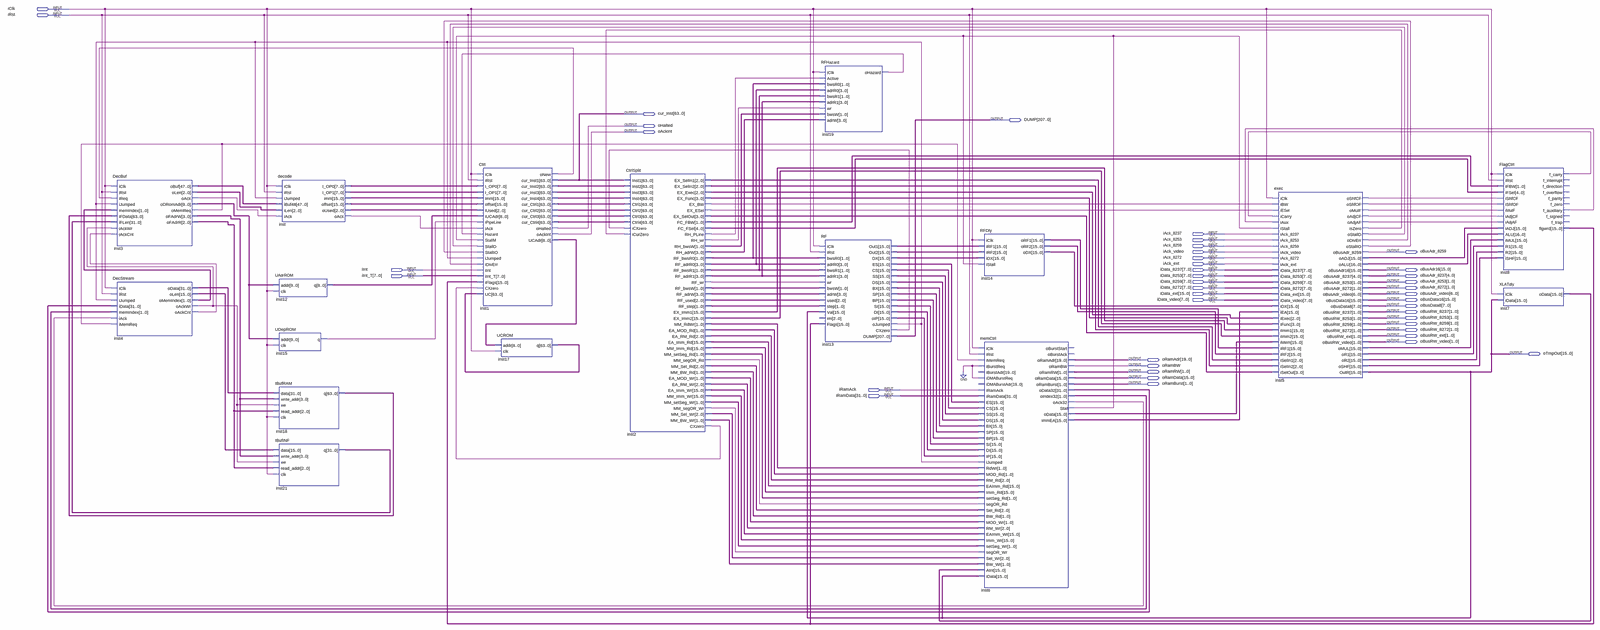
[diagram p0: schematic sheet, whole]
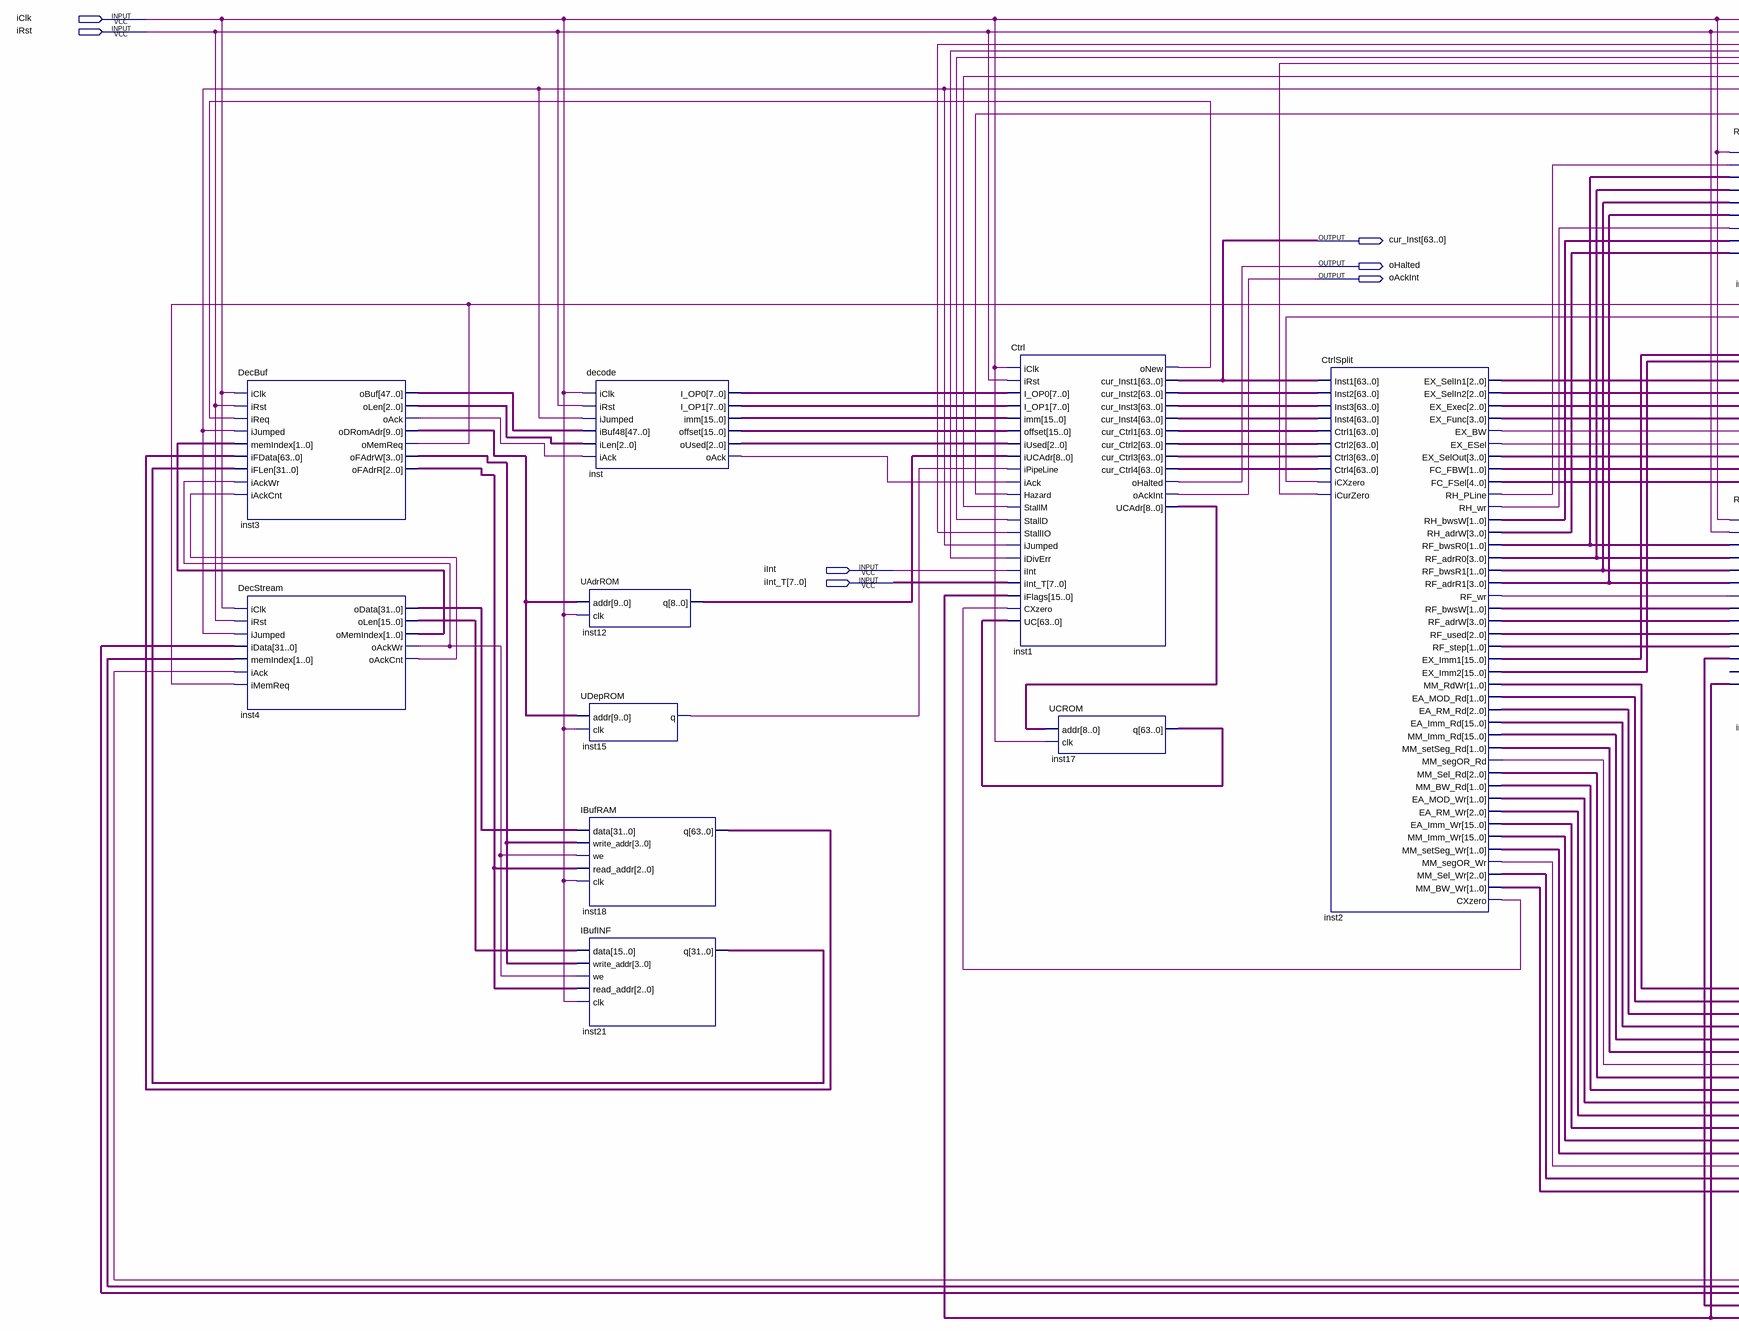
[diagram p1: schematic sheet, left part]
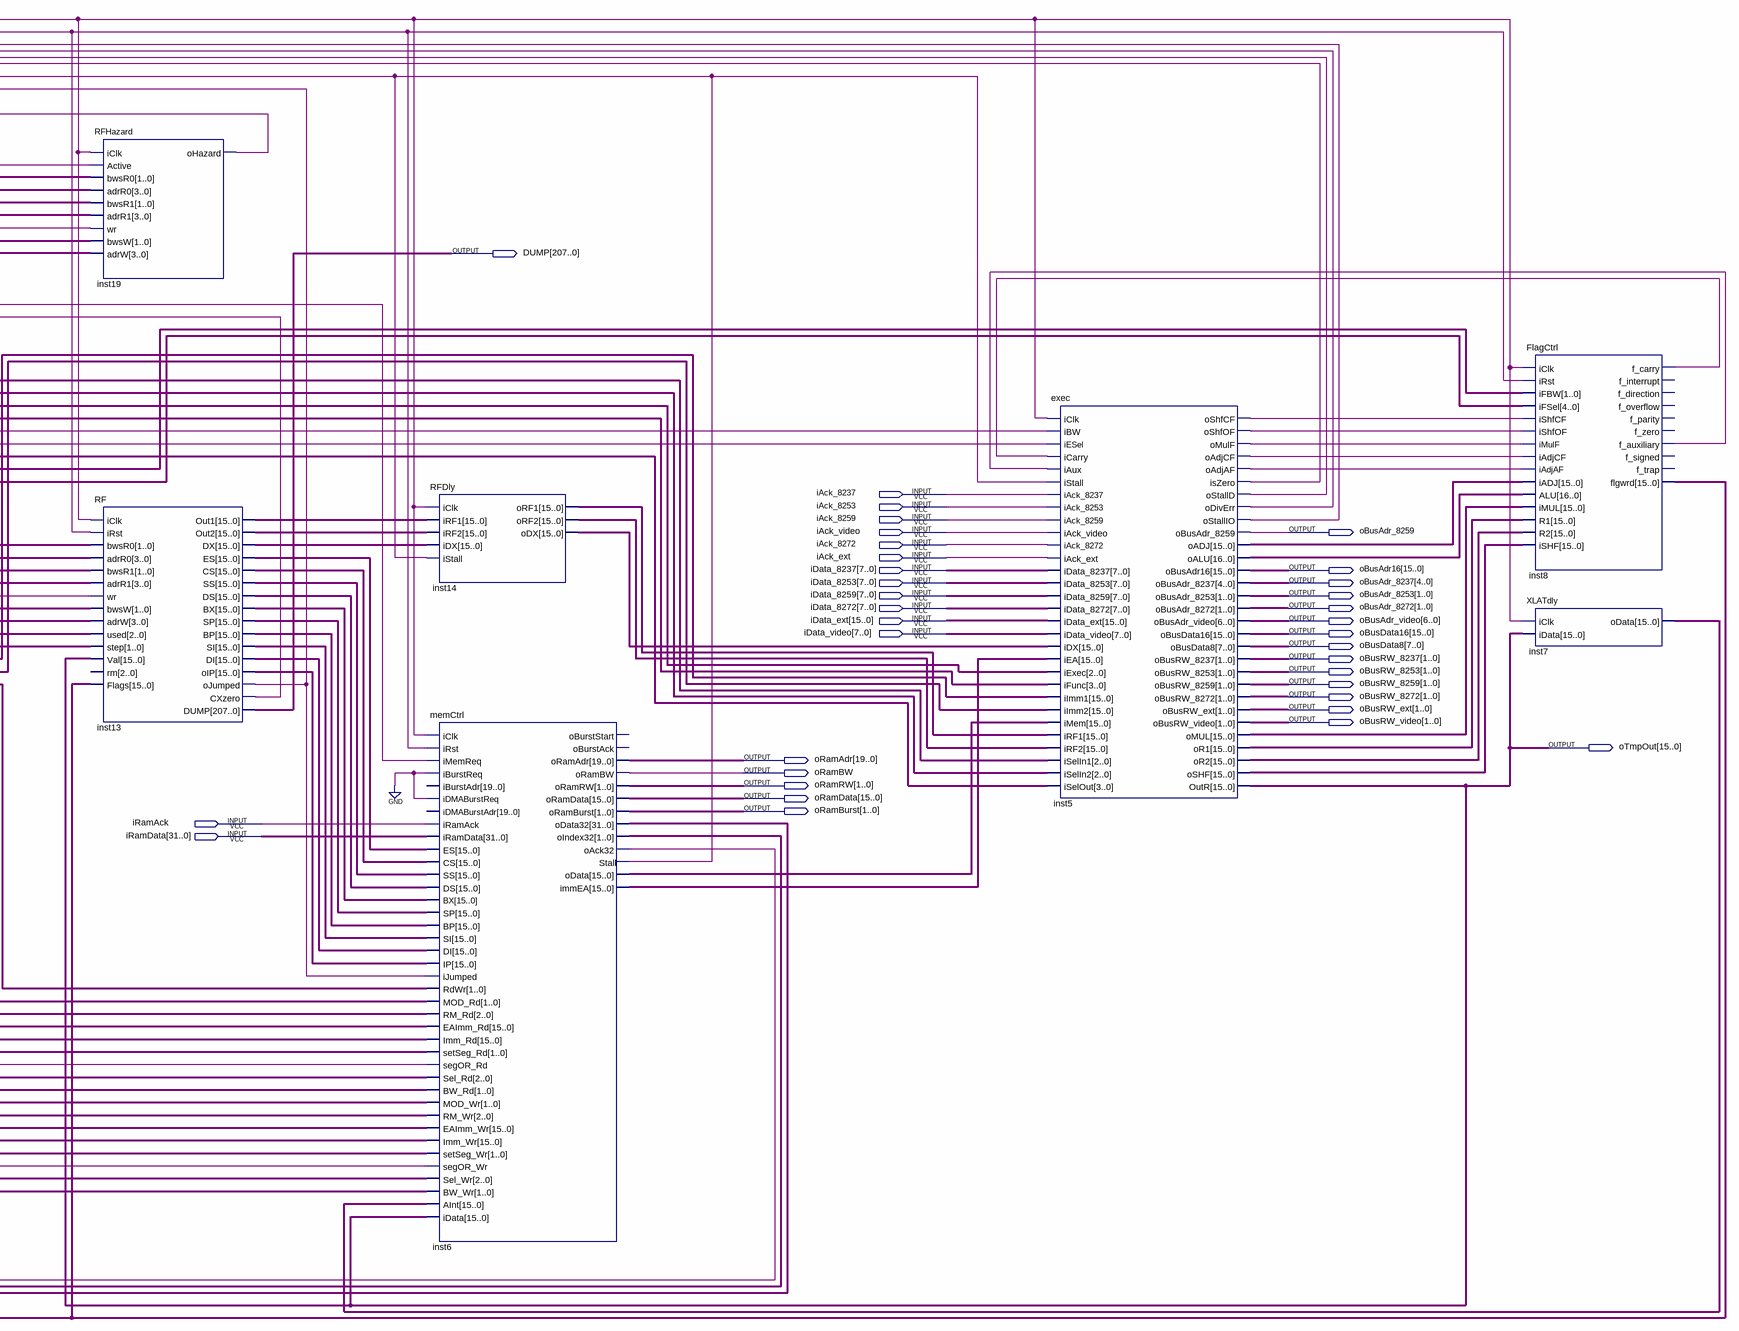
[diagram p2: schematic sheet, right part]
// Quartus schematic cpu_top.bdf as structural Verilog: 17 symbols, 42 pins
module cpu_top (
  input  iClk,
  input  iRst,
  input  iAck_8237,
  input  iAck_8253,
  input  iAck_8259,
  input  iAck_video,
  input  iAck_8272,
  input  iAck_ext,
  input  iInt,
  input  [7:0] iData_8237,
  input  [7:0] iInt_T,
  input  [7:0] iData_8253,
  input  [7:0] iData_8259,
  input  [7:0] iData_8272,
  input  [15:0] iData_ext,
  input  [7:0] iData_video,
  input  iRamAck,
  input  [31:0] iRamData,
  output [63:0] cur_Inst,
  output [207:0] DUMP,
  output oHalted,
  output oAckInt,
  output oBusAdr_8259,
  output [15:0] oBusAdr16,
  output [4:0] oBusAdr_8237,
  output [1:0] oBusAdr_8253,
  output [1:0] oBusAdr_8272,
  output [6:0] oBusAdr_video,
  output [15:0] oBusData16,
  output [7:0] oBusData8,
  output [1:0] oBusRW_8237,
  output [1:0] oBusRW_8253,
  output [1:0] oBusRW_8259,
  output [1:0] oBusRW_8272,
  output [1:0] oBusRW_ext,
  output [1:0] oBusRW_video,
  output [15:0] oTmpOut,
  output [19:0] oRamAdr,
  output oRamBW,
  output [1:0] oRamRW,
  output [15:0] oRamData,
  output [1:0] oRamBurst
);

  wire inst1_onew, inst2_cxzero, inst2_ex_bw, inst2_ex_esel, inst2_mm_segor_rd, inst2_mm_segor_wr,
       inst2_rf_wr, inst2_rh_pline, inst2_rh_wr, inst3_oack, inst3_omemreq, inst4_oackcnt, inst4_oackwr,
       inst5_iszero, inst5_oadjaf, inst5_oadjcf, inst5_odiverr, inst5_omulf, inst5_oshfcf, inst5_oshfof,
       inst5_ostalld, inst5_ostallio, inst6_oack32, inst6_stall, inst8_f_auxiliary, inst8_f_carry,
       inst13_cxzero, inst13_ojumped, inst15_q, inst19_ohazard, inst_oack;
  wire [1:0] inst2_ea_mod_rd, inst2_ea_mod_wr, inst2_fc_fbw, inst2_mm_bw_rd, inst2_mm_bw_wr, inst2_mm_rdwr,
       inst2_mm_setseg_rd, inst2_mm_setseg_wr, inst2_rf_bwsr0, inst2_rf_bwsr1, inst2_rf_bwsw, inst2_rf_step,
       inst2_rh_bwsw, inst4_omemindex, inst6_oindex32;
  wire [2:0] inst2_ea_rm_rd, inst2_ea_rm_wr, inst2_ex_exec, inst2_ex_selin1, inst2_ex_selin2,
       inst2_mm_sel_rd, inst2_mm_sel_wr, inst2_rf_used, inst3_ofadrr, inst3_olen, inst_oused;
  wire [3:0] inst2_ex_func, inst2_ex_selout, inst2_rf_adrr0, inst2_rf_adrr1, inst2_rf_adrw, inst2_rh_adrw,
       inst3_ofadrw;
  wire [4:0] inst2_fc_fsel;
  wire [7:0] inst_i_op0, inst_i_op1;
  wire [8:0] inst1_ucadr, inst12_q;
  wire [9:0] inst3_odromadr;
  wire [15:0] inst2_ea_imm_rd, inst2_ea_imm_wr, inst2_ex_imm1, inst2_ex_imm2, inst2_mm_imm_rd,
       inst2_mm_imm_wr, inst4_olen, inst5_oadj, inst5_omul, inst5_or1, inst5_or2, inst5_oshf, inst6_immea,
       inst6_odata, inst7_odata, inst8_flgwrd, inst13_bp, inst13_bx, inst13_cs, inst13_di, inst13_ds,
       inst13_dx, inst13_es, inst13_oip, inst13_out1, inst13_out2, inst13_si, inst13_sp, inst13_ss,
       inst14_odx, inst14_orf1, inst14_orf2, inst_imm, inst_offset;
  wire [16:0] inst5_oalu;
  wire [31:0] inst4_odata, inst6_odata32, inst21_q;
  wire [47:0] inst3_obuf;
  wire [63:0] inst1_cur_ctrl1, inst1_cur_ctrl2, inst1_cur_ctrl3, inst1_cur_ctrl4, inst1_cur_inst2,
       inst1_cur_inst3, inst1_cur_inst4, inst17_q, inst18_q;

  DecBuf inst3 (
    .iClk(iClk), .iRst(iRst), .iReq(inst1_onew), .iJumped(inst13_ojumped), .memIndex(inst4_omemindex),
    .iFData(inst18_q), .iFLen(inst21_q), .iAckWr(inst4_oackwr), .iAckCnt(inst4_oackcnt), .oBuf(inst3_obuf),
    .oLen(inst3_olen), .oAck(inst3_oack), .oDRomAdr(inst3_odromadr), .oMemReq(inst3_omemreq),
    .oFAdrW(inst3_ofadrw), .oFAdrR(inst3_ofadrr));
  DecStream inst4 (
    .iClk(iClk), .iRst(iRst), .iJumped(inst13_ojumped), .iData(inst6_odata32), .memIndex(inst6_oindex32),
    .iAck(inst6_oack32), .iMemReq(inst3_omemreq), .oData(inst4_odata), .oLen(inst4_olen),
    .oMemIndex(inst4_omemindex), .oAckWr(inst4_oackwr), .oAckCnt(inst4_oackcnt));
  UAdrROM inst12 (.addr(inst3_odromadr), .clk(iClk), .q(inst12_q));
  UDepROM inst15 (.addr(inst3_odromadr), .clk(iClk), .q(inst15_q));
  IBufRAM inst18 (
    .data(inst4_odata), .write_addr(inst3_ofadrw), .we(inst4_oackwr), .read_addr(inst3_ofadrr), .clk(iClk),
    .q(inst18_q));
  IBufINF inst21 (
    .data(inst4_olen), .write_addr(inst3_ofadrw), .we(inst4_oackwr), .read_addr(inst3_ofadrr), .clk(iClk),
    .q(inst21_q));
  decode inst (
    .iClk(iClk), .iRst(iRst), .iJumped(inst13_ojumped), .iBuf48(inst3_obuf), .iLen(inst3_olen),
    .iAck(inst3_oack), .I_OP0(inst_i_op0), .I_OP1(inst_i_op1), .imm(inst_imm), .offset(inst_offset),
    .oUsed(inst_oused), .oAck(inst_oack));
  Ctrl inst1 (
    .iClk(iClk), .iRst(iRst), .I_OP0(inst_i_op0), .I_OP1(inst_i_op1), .imm(inst_imm), .offset(inst_offset),
    .iUsed(inst_oused), .iUCAdr(inst12_q), .iPipeLine(inst15_q), .iAck(inst_oack), .Hazard(inst19_ohazard),
    .StallM(inst6_stall), .StallD(inst5_ostalld), .StallIO(inst5_ostallio), .iJumped(inst13_ojumped),
    .iDivErr(inst5_odiverr), .iInt(iInt), .iInt_T(iInt_T), .iFlags(inst8_flgwrd), .CXzero(inst2_cxzero),
    .UC(inst17_q), .oNew(inst1_onew), .cur_Inst1(cur_Inst), .cur_Inst2(inst1_cur_inst2),
    .cur_Inst3(inst1_cur_inst3), .cur_Inst4(inst1_cur_inst4), .cur_Ctrl1(inst1_cur_ctrl1),
    .cur_Ctrl2(inst1_cur_ctrl2), .cur_Ctrl3(inst1_cur_ctrl3), .cur_Ctrl4(inst1_cur_ctrl4), .oHalted(oHalted),
    .oAckInt(oAckInt), .UCAdr(inst1_ucadr));
  UCROM inst17 (.addr(inst1_ucadr), .clk(iClk), .q(inst17_q));
  CtrlSplit inst2 (
    .Inst1(cur_Inst), .Inst2(inst1_cur_inst2), .Inst3(inst1_cur_inst3), .Inst4(inst1_cur_inst4),
    .Ctrl1(inst1_cur_ctrl1), .Ctrl2(inst1_cur_ctrl2), .Ctrl3(inst1_cur_ctrl3), .Ctrl4(inst1_cur_ctrl4),
    .iCXzero(inst13_cxzero), .iCurZero(inst5_iszero), .EX_SelIn1(inst2_ex_selin1),
    .EX_SelIn2(inst2_ex_selin2), .EX_Exec(inst2_ex_exec), .EX_Func(inst2_ex_func), .EX_BW(inst2_ex_bw),
    .EX_ESel(inst2_ex_esel), .EX_SelOut(inst2_ex_selout), .FC_FBW(inst2_fc_fbw), .FC_FSel(inst2_fc_fsel),
    .RH_PLine(inst2_rh_pline), .RH_wr(inst2_rh_wr), .RH_bwsW(inst2_rh_bwsw), .RH_adrW(inst2_rh_adrw),
    .RF_bwsR0(inst2_rf_bwsr0), .RF_adrR0(inst2_rf_adrr0), .RF_bwsR1(inst2_rf_bwsr1),
    .RF_adrR1(inst2_rf_adrr1), .RF_wr(inst2_rf_wr), .RF_bwsW(inst2_rf_bwsw), .RF_adrW(inst2_rf_adrw),
    .RF_used(inst2_rf_used), .RF_step(inst2_rf_step), .EX_Imm1(inst2_ex_imm1), .EX_Imm2(inst2_ex_imm2),
    .MM_RdWr(inst2_mm_rdwr), .EA_MOD_Rd(inst2_ea_mod_rd), .EA_RM_Rd(inst2_ea_rm_rd),
    .EA_Imm_Rd(inst2_ea_imm_rd), .MM_Imm_Rd(inst2_mm_imm_rd), .MM_setSeg_Rd(inst2_mm_setseg_rd),
    .MM_segOR_Rd(inst2_mm_segor_rd), .MM_Sel_Rd(inst2_mm_sel_rd), .MM_BW_Rd(inst2_mm_bw_rd),
    .EA_MOD_Wr(inst2_ea_mod_wr), .EA_RM_Wr(inst2_ea_rm_wr), .EA_Imm_Wr(inst2_ea_imm_wr),
    .MM_Imm_Wr(inst2_mm_imm_wr), .MM_setSeg_Wr(inst2_mm_setseg_wr), .MM_segOR_Wr(inst2_mm_segor_wr),
    .MM_Sel_Wr(inst2_mm_sel_wr), .MM_BW_Wr(inst2_mm_bw_wr), .CXzero(inst2_cxzero));
  RFHazard inst19 (
    .iClk(iClk), .Active(inst2_rh_pline), .bwsR0(inst2_rf_bwsr0), .adrR0(inst2_rf_adrr0),
    .bwsR1(inst2_rf_bwsr1), .adrR1(inst2_rf_adrr1), .wr(inst2_rh_wr), .bwsW(inst2_rh_bwsw),
    .adrW(inst2_rh_adrw), .oHazard(inst19_ohazard));
  RF inst13 (
    .iClk(iClk), .iRst(iRst), .bwsR0(inst2_rf_bwsr0), .adrR0(inst2_rf_adrr0), .bwsR1(inst2_rf_bwsr1),
    .adrR1(inst2_rf_adrr1), .wr(inst2_rf_wr), .bwsW(inst2_rf_bwsw), .adrW(inst2_rf_adrw),
    .used(inst2_rf_used), .step(inst2_rf_step), .Val(oTmpOut), .Flags(inst8_flgwrd), .Out1(inst13_out1),
    .Out2(inst13_out2), .DX(inst13_dx), .ES(inst13_es), .CS(inst13_cs), .SS(inst13_ss), .DS(inst13_ds),
    .BX(inst13_bx), .SP(inst13_sp), .BP(inst13_bp), .SI(inst13_si), .DI(inst13_di), .oIP(inst13_oip),
    .oJumped(inst13_ojumped), .CXzero(inst13_cxzero), .DUMP(DUMP));  // open: rm
  RFDly inst14 (
    .iClk(iClk), .iRF1(inst13_out1), .iRF2(inst13_out2), .iDX(inst13_dx), .iStall(inst6_stall),
    .oRF1(inst14_orf1), .oRF2(inst14_orf2), .oDX(inst14_odx));
  memCtrl inst6 (
    .iClk(iClk), .iRst(iRst), .iMemReq(inst3_omemreq), .iBurstReq(1'b0), .iDMABurstReq(1'b0),
    .iRamAck(iRamAck), .iRamData(iRamData), .ES(inst13_es), .CS(inst13_cs), .SS(inst13_ss), .DS(inst13_ds),
    .BX(inst13_bx), .SP(inst13_sp), .BP(inst13_bp), .SI(inst13_si), .DI(inst13_di), .IP(inst13_oip),
    .iJumped(inst13_ojumped), .RdWr(inst2_mm_rdwr), .MOD_Rd(inst2_ea_mod_rd), .RM_Rd(inst2_ea_rm_rd),
    .EAImm_Rd(inst2_ea_imm_rd), .Imm_Rd(inst2_mm_imm_rd), .setSeg_Rd(inst2_mm_setseg_rd),
    .segOR_Rd(inst2_mm_segor_rd), .Sel_Rd(inst2_mm_sel_rd), .BW_Rd(inst2_mm_bw_rd), .MOD_Wr(inst2_ea_mod_wr),
    .RM_Wr(inst2_ea_rm_wr), .EAImm_Wr(inst2_ea_imm_wr), .Imm_Wr(inst2_mm_imm_wr),
    .setSeg_Wr(inst2_mm_setseg_wr), .segOR_Wr(inst2_mm_segor_wr), .Sel_Wr(inst2_mm_sel_wr),
    .BW_Wr(inst2_mm_bw_wr), .AInt(inst7_odata), .iData(oTmpOut), .oRamAdr(oRamAdr), .oRamBW(oRamBW),
    .oRamRW(oRamRW), .oRamData(oRamData), .oRamBurst(oRamBurst), .oData32(inst6_odata32),
    .oIndex32(inst6_oindex32), .oAck32(inst6_oack32), .Stall(inst6_stall), .oData(inst6_odata),
    .immEA(inst6_immea));  // open: iBurstAdr, iDMABurstAdr, oBurstStart, oBurstAck
  exec inst5 (
    .iClk(iClk), .iBW(inst2_ex_bw), .iESel(inst2_ex_esel), .iCarry(inst8_f_carry), .iAux(inst8_f_auxiliary),
    .iStall(inst6_stall), .iAck_8237(iAck_8237), .iAck_8253(iAck_8253), .iAck_8259(iAck_8259),
    .iAck_video(iAck_video), .iAck_8272(iAck_8272), .iAck_ext(iAck_ext), .iData_8237(iData_8237),
    .iData_8253(iData_8253), .iData_8259(iData_8259), .iData_8272(iData_8272), .iData_ext(iData_ext),
    .iData_video(iData_video), .iDX(inst14_odx), .iEA(inst6_immea), .iExec(inst2_ex_exec),
    .iFunc(inst2_ex_func), .iImm1(inst2_ex_imm1), .iImm2(inst2_ex_imm2), .iMem(inst6_odata),
    .iRF1(inst14_orf1), .iRF2(inst14_orf2), .iSelIn1(inst2_ex_selin1), .iSelIn2(inst2_ex_selin2),
    .iSelOut(inst2_ex_selout), .oShfCF(inst5_oshfcf), .oShfOF(inst5_oshfof), .oMulF(inst5_omulf),
    .oAdjCF(inst5_oadjcf), .oAdjAF(inst5_oadjaf), .isZero(inst5_iszero), .oStallD(inst5_ostalld),
    .oDivErr(inst5_odiverr), .oStallIO(inst5_ostallio), .oBusAdr_8259(oBusAdr_8259), .oADJ(inst5_oadj),
    .oALU(inst5_oalu), .oBusAdr16(oBusAdr16), .oBusAdr_8237(oBusAdr_8237), .oBusAdr_8253(oBusAdr_8253),
    .oBusAdr_8272(oBusAdr_8272), .oBusAdr_video(oBusAdr_video), .oBusData16(oBusData16),
    .oBusData8(oBusData8), .oBusRW_8237(oBusRW_8237), .oBusRW_8253(oBusRW_8253), .oBusRW_8259(oBusRW_8259),
    .oBusRW_8272(oBusRW_8272), .oBusRW_ext(oBusRW_ext), .oBusRW_video(oBusRW_video), .oMUL(inst5_omul),
    .oR1(inst5_or1), .oR2(inst5_or2), .oSHF(inst5_oshf), .OutR(oTmpOut));
  FlagCtrl inst8 (
    .iClk(iClk), .iRst(iRst), .iFBW(inst2_fc_fbw), .iFSel(inst2_fc_fsel), .iShfCF(inst5_oshfcf),
    .iShfOF(inst5_oshfof), .iMulF(inst5_omulf), .iAdjCF(inst5_oadjcf), .iAdjAF(inst5_oadjaf),
    .iADJ(inst5_oadj), .ALU(inst5_oalu), .iMUL(inst5_omul), .R1(inst5_or1), .R2(inst5_or2),
    .iSHF(inst5_oshf), .f_carry(inst8_f_carry), .f_auxiliary(inst8_f_auxiliary), .flgwrd(inst8_flgwrd));  // open: f_interrupt, f_direction, f_overflow, f_parity, f_zero, f_signed, f_trap
  XLATdly inst7 (.iClk(iClk), .iData(oTmpOut), .oData(inst7_odata));
endmodule
